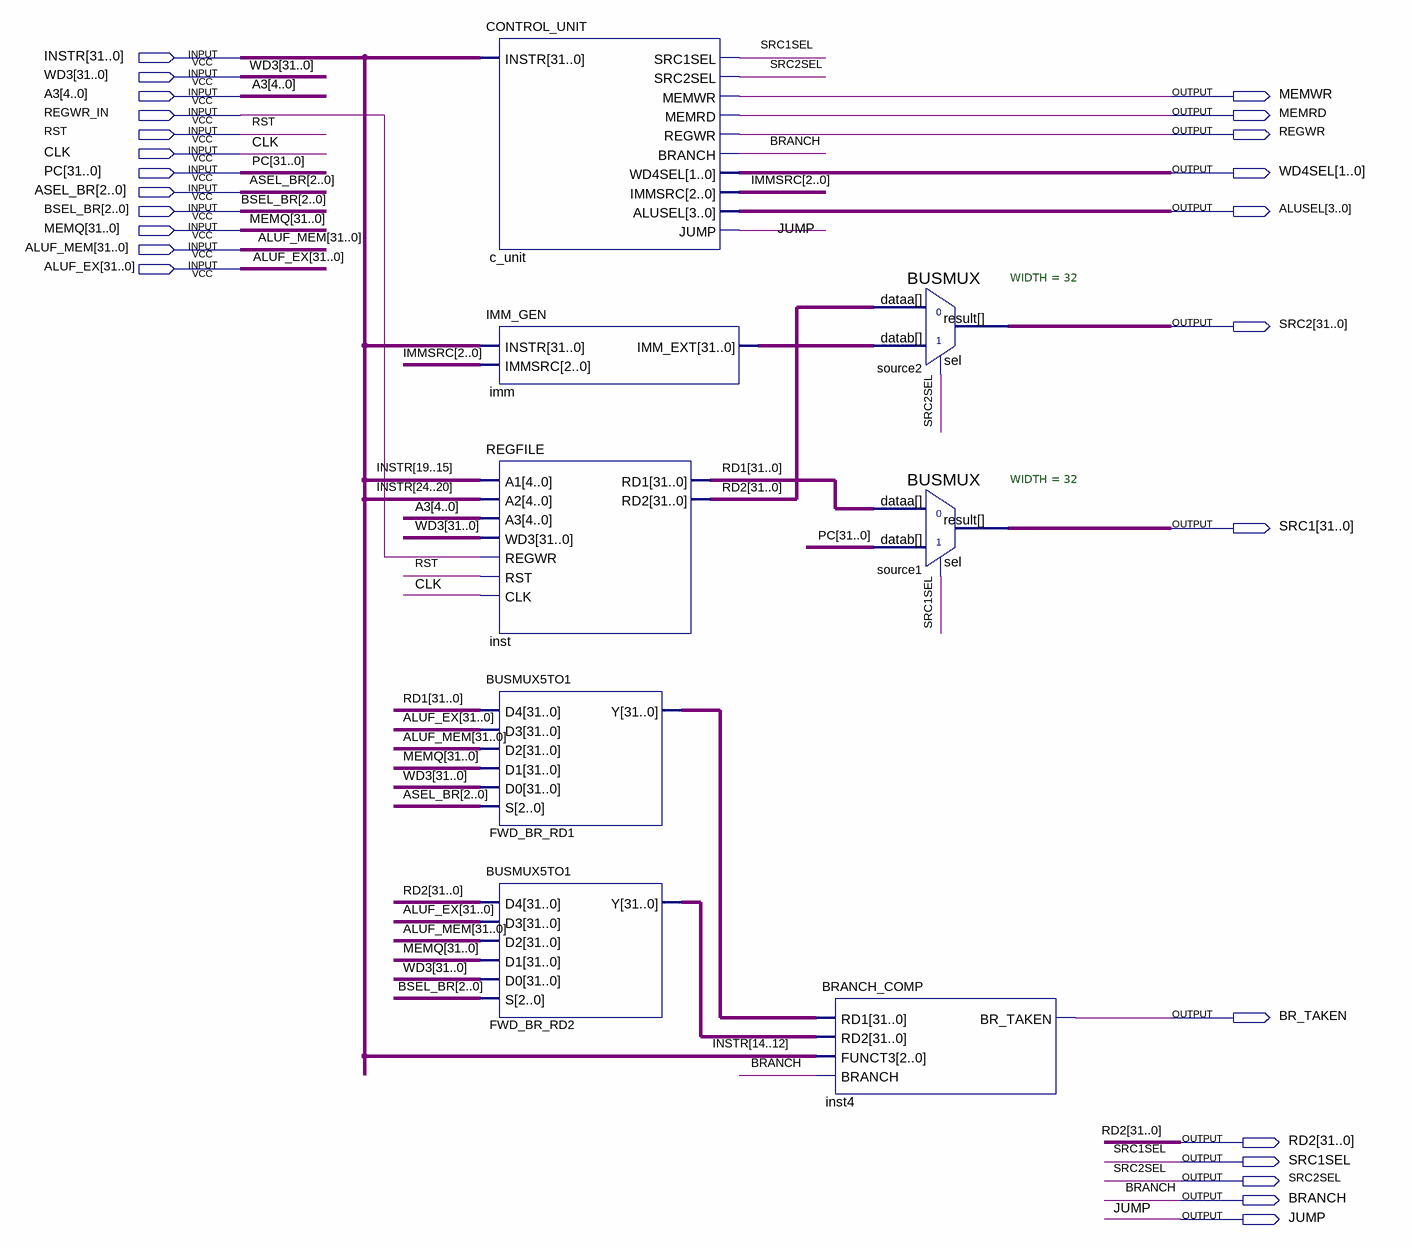
[diagram p0: schematic sheet]
// Quartus schematic decode.bdf as structural Verilog: 8 symbols, 25 pins
module decode (
  input  [31:0] INSTR,
  input  [31:0] WD3,
  input  [4:0] A3,
  input  REGWR_IN,
  input  RST,
  input  CLK,
  input  [31:0] PC,
  input  [2:0] ASEL_BR,
  input  [2:0] BSEL_BR,
  input  [31:0] MEMQ,
  input  [31:0] ALUF_MEM,
  input  [31:0] ALUF_EX,
  output MEMWR,
  output MEMRD,
  output REGWR,
  output [1:0] WD4SEL,
  output [3:0] ALUSEL,
  output [31:0] SRC2,
  output [31:0] SRC1,
  output BR_TAKEN,
  output [31:0] RD2,
  output SRC1SEL,
  output SRC2SEL,
  output BRANCH,
  output JUMP
);

  wire [2:0] IMMSRC;
  wire [31:0] FWD_BR_RD1_y, FWD_BR_RD2_y, imm_imm_ext, RD1;

  CONTROL_UNIT c_unit (
    .INSTR(INSTR), .SRC1SEL(SRC1SEL), .SRC2SEL(SRC2SEL), .MEMWR(MEMWR), .MEMRD(MEMRD), .REGWR(REGWR),
    .BRANCH(BRANCH), .WD4SEL(WD4SEL), .IMMSRC(IMMSRC), .ALUSEL(ALUSEL), .JUMP(JUMP));
  IMM_GEN imm (.INSTR(INSTR), .IMMSRC(IMMSRC), .IMM_EXT(imm_imm_ext));
  REGFILE inst (
    .A1(INSTR[19:15]), .A2(INSTR[24:20]), .A3(A3), .WD3(WD3), .REGWR(REGWR_IN), .RST(RST), .CLK(CLK),
    .RD1(RD1), .RD2(RD2));
  BUSMUX5TO1 FWD_BR_RD1 (.D4(RD1), .D3(ALUF_EX), .D2(ALUF_MEM), .D1(MEMQ), .D0(WD3), .S(ASEL_BR), .Y(FWD_BR_RD1_y));
  BUSMUX5TO1 FWD_BR_RD2 (.D4(RD2), .D3(ALUF_EX), .D2(ALUF_MEM), .D1(MEMQ), .D0(WD3), .S(BSEL_BR), .Y(FWD_BR_RD2_y));
  BRANCH_COMP inst4 (
    .RD1(FWD_BR_RD1_y), .RD2(FWD_BR_RD2_y), .FUNCT3(INSTR[14:12]), .BRANCH(BRANCH), .BR_TAKEN(BR_TAKEN));
  BUSMUX #(.WIDTH(32)) source2 (.datab(imm_imm_ext), .sel(SRC2SEL), .dataa(RD2), .result(SRC2));
  BUSMUX #(.WIDTH(32)) source1 (.datab(PC), .sel(SRC1SEL), .dataa(RD1), .result(SRC1));
endmodule
